# Altium schematic sheet MutiSheet.SchDoc
size B
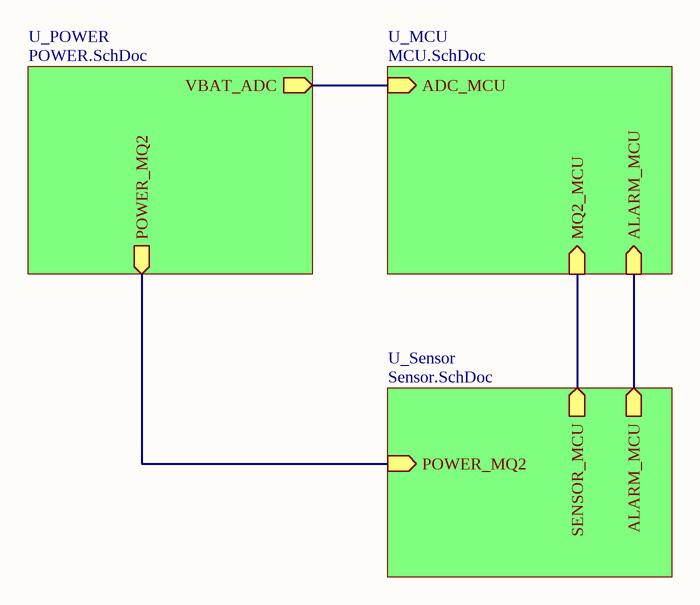
[diagram p0: MutiSheet.SchDoc]

## Sub-sheets
U_MCU = MCU.SchDoc: ADC_MCU (in), ALARM_MCU (in), MQ2_MCU (in)
U_POWER = POWER.SchDoc: VBAT_ADC (out), POWER_MQ2 (out)
U_Sensor = Sensor.SchDoc: ALARM_MCU (out), SENSOR_MCU (out), POWER_MQ2 (in)

## Nets
(unnamed): sheet U_MCU/ADC_MCU, sheet U_POWER/VBAT_ADC
(unnamed): sheet U_MCU/ALARM_MCU, sheet U_Sensor/ALARM_MCU
(unnamed): sheet U_MCU/MQ2_MCU, sheet U_Sensor/SENSOR_MCU
(unnamed): sheet U_POWER/POWER_MQ2, sheet U_Sensor/POWER_MQ2